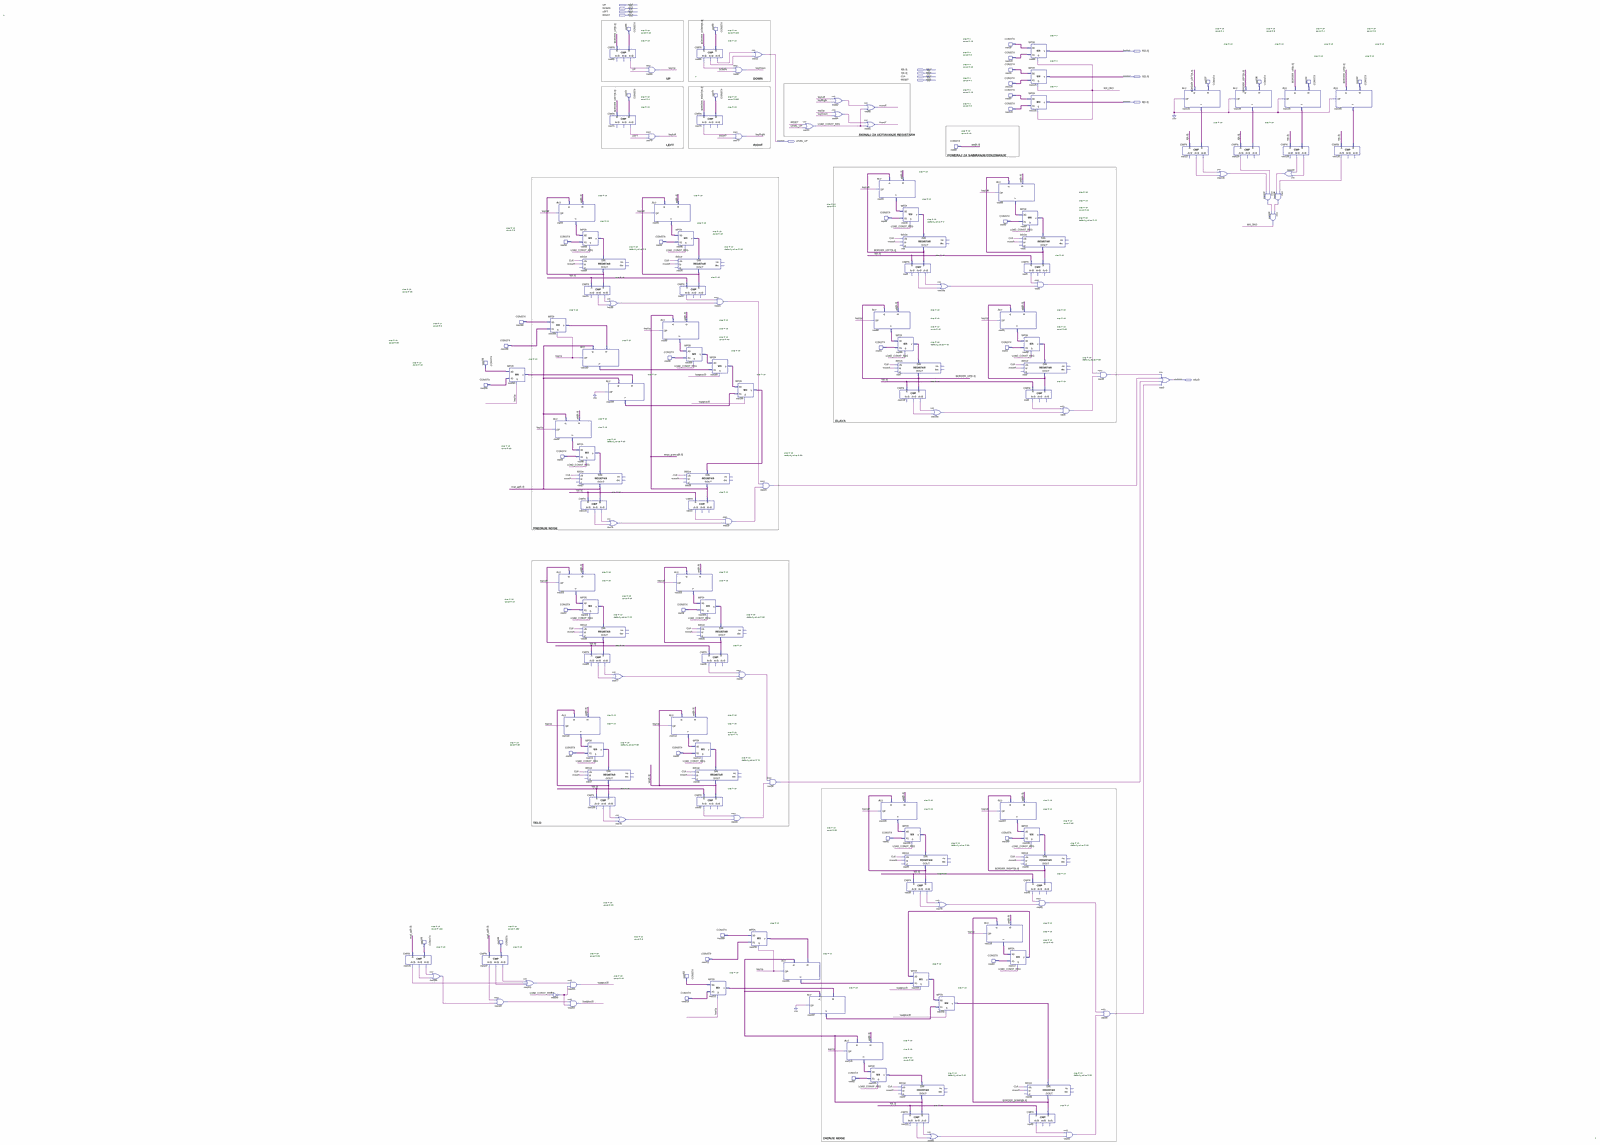
[diagram p0: schematic sheet, whole]
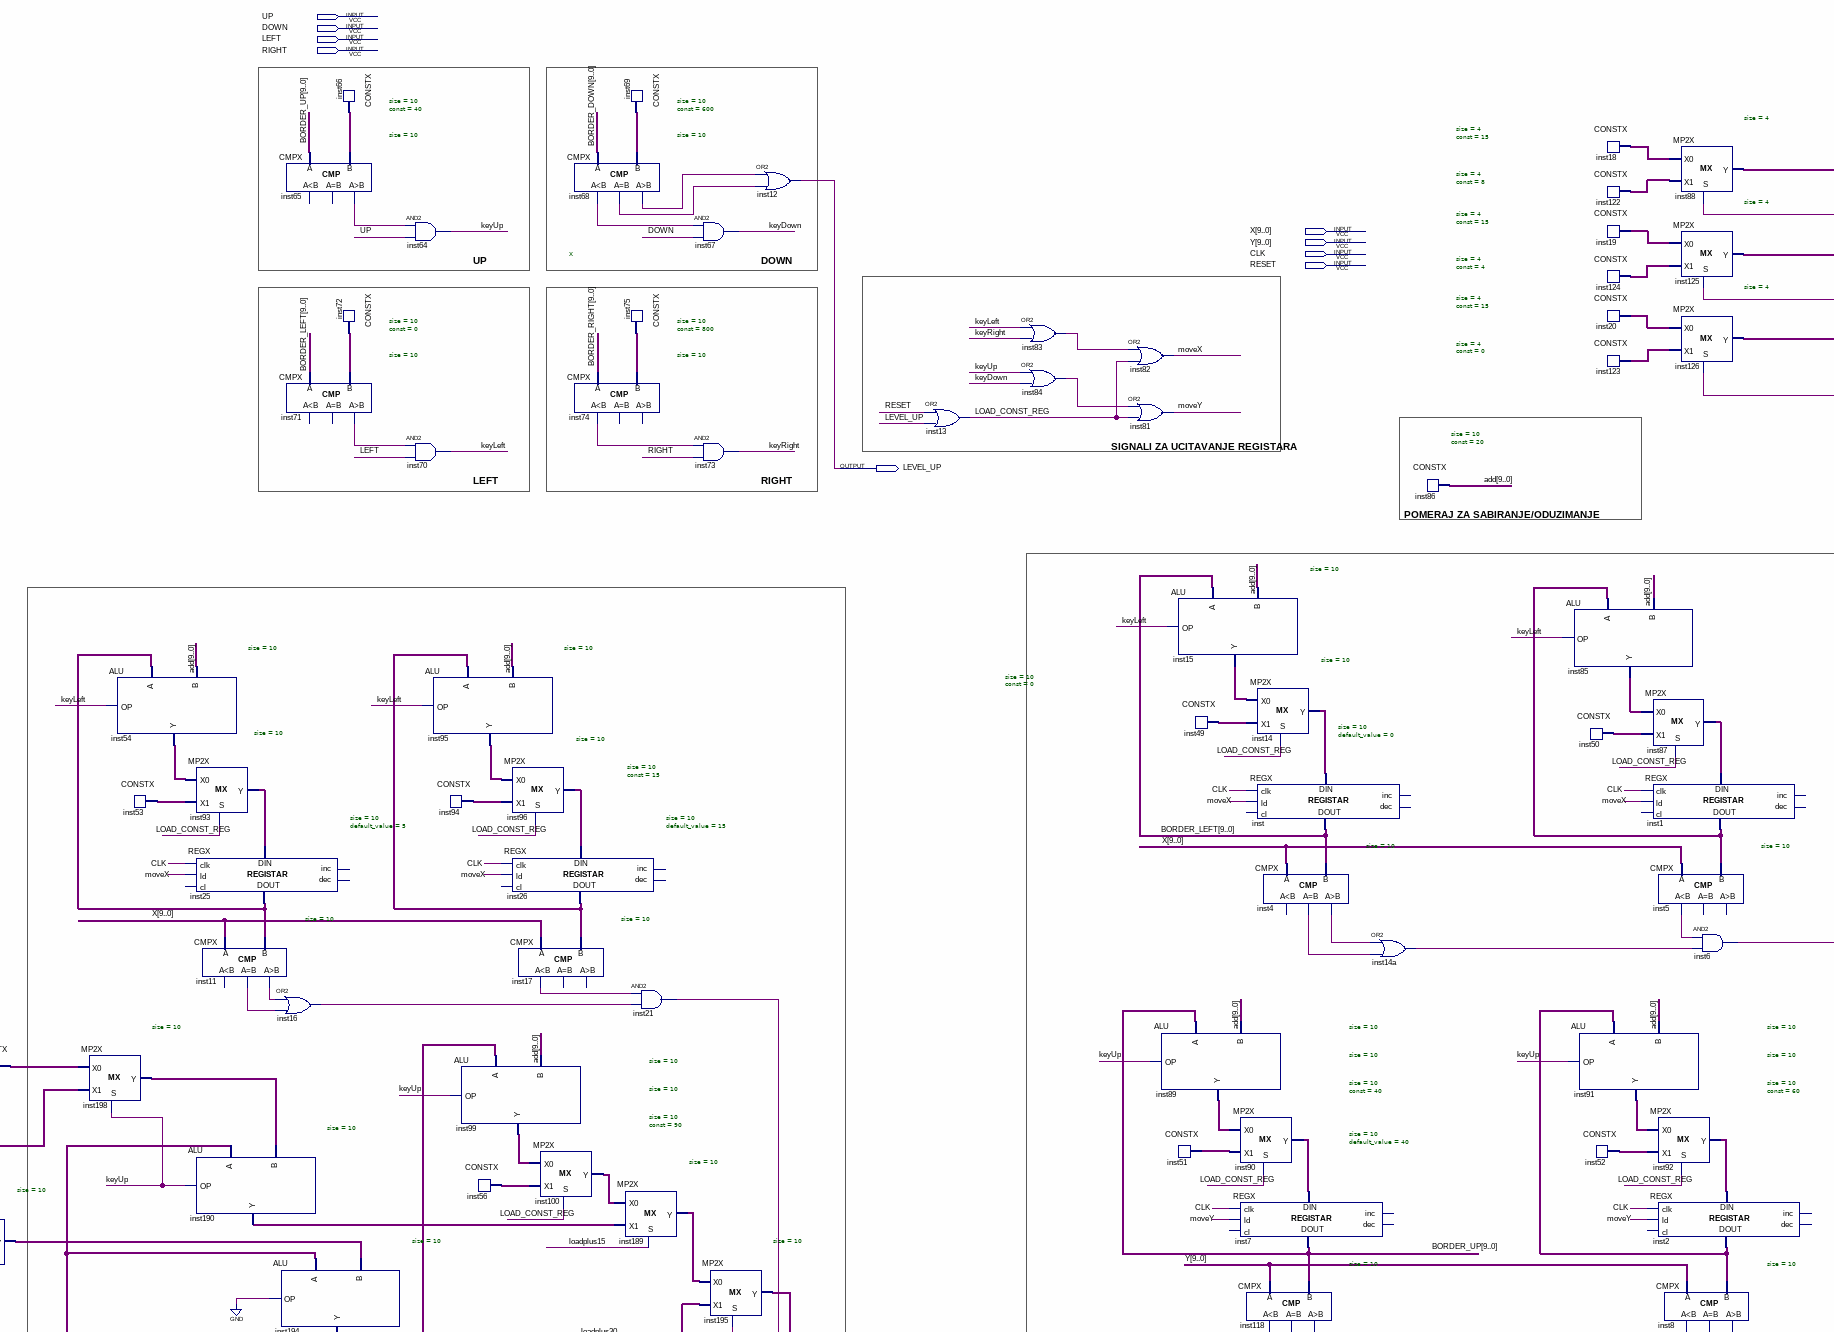
[diagram p1: schematic sheet, upper centre part]
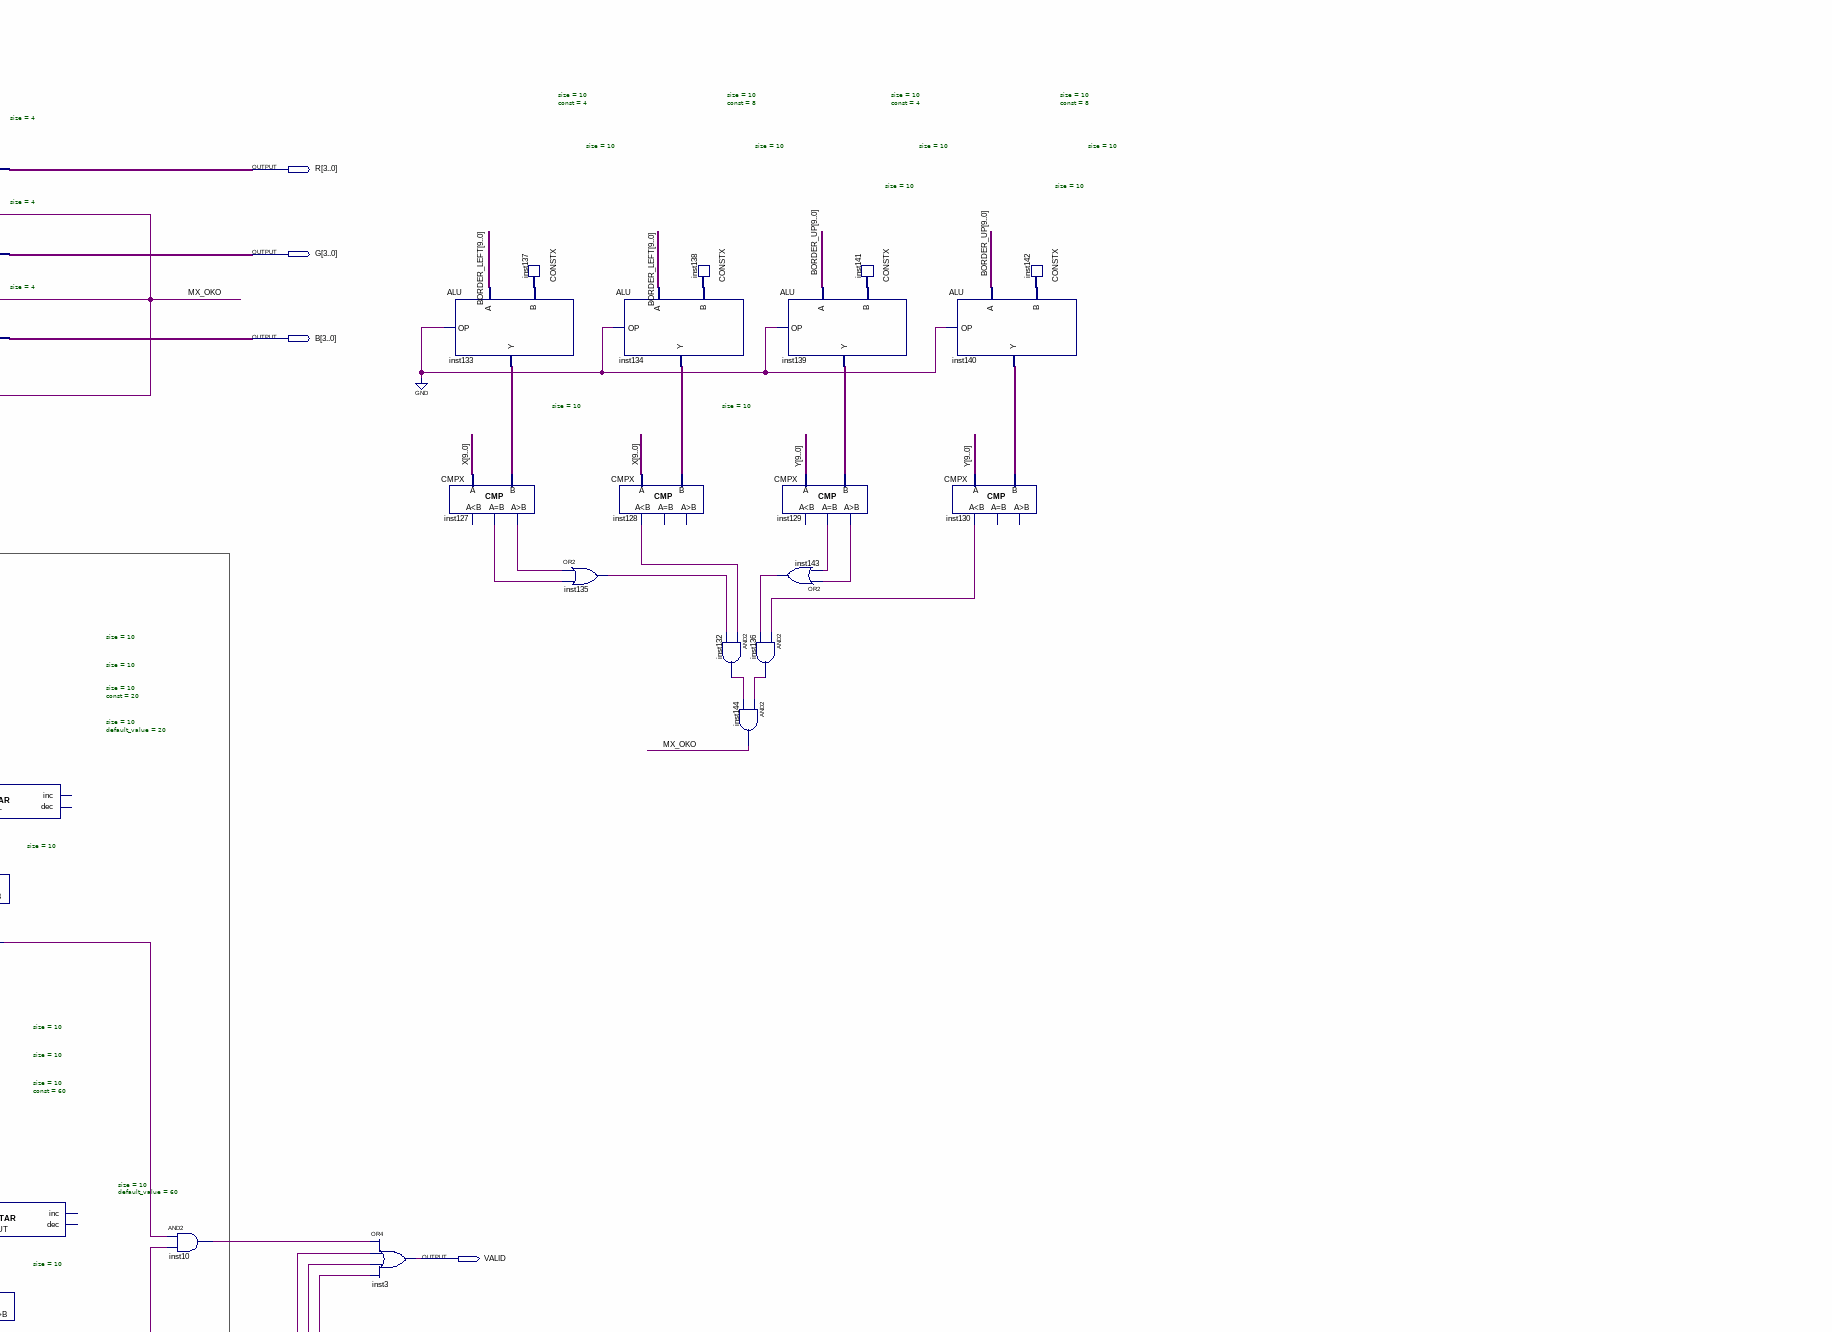
[diagram p2: schematic sheet, upper right part]
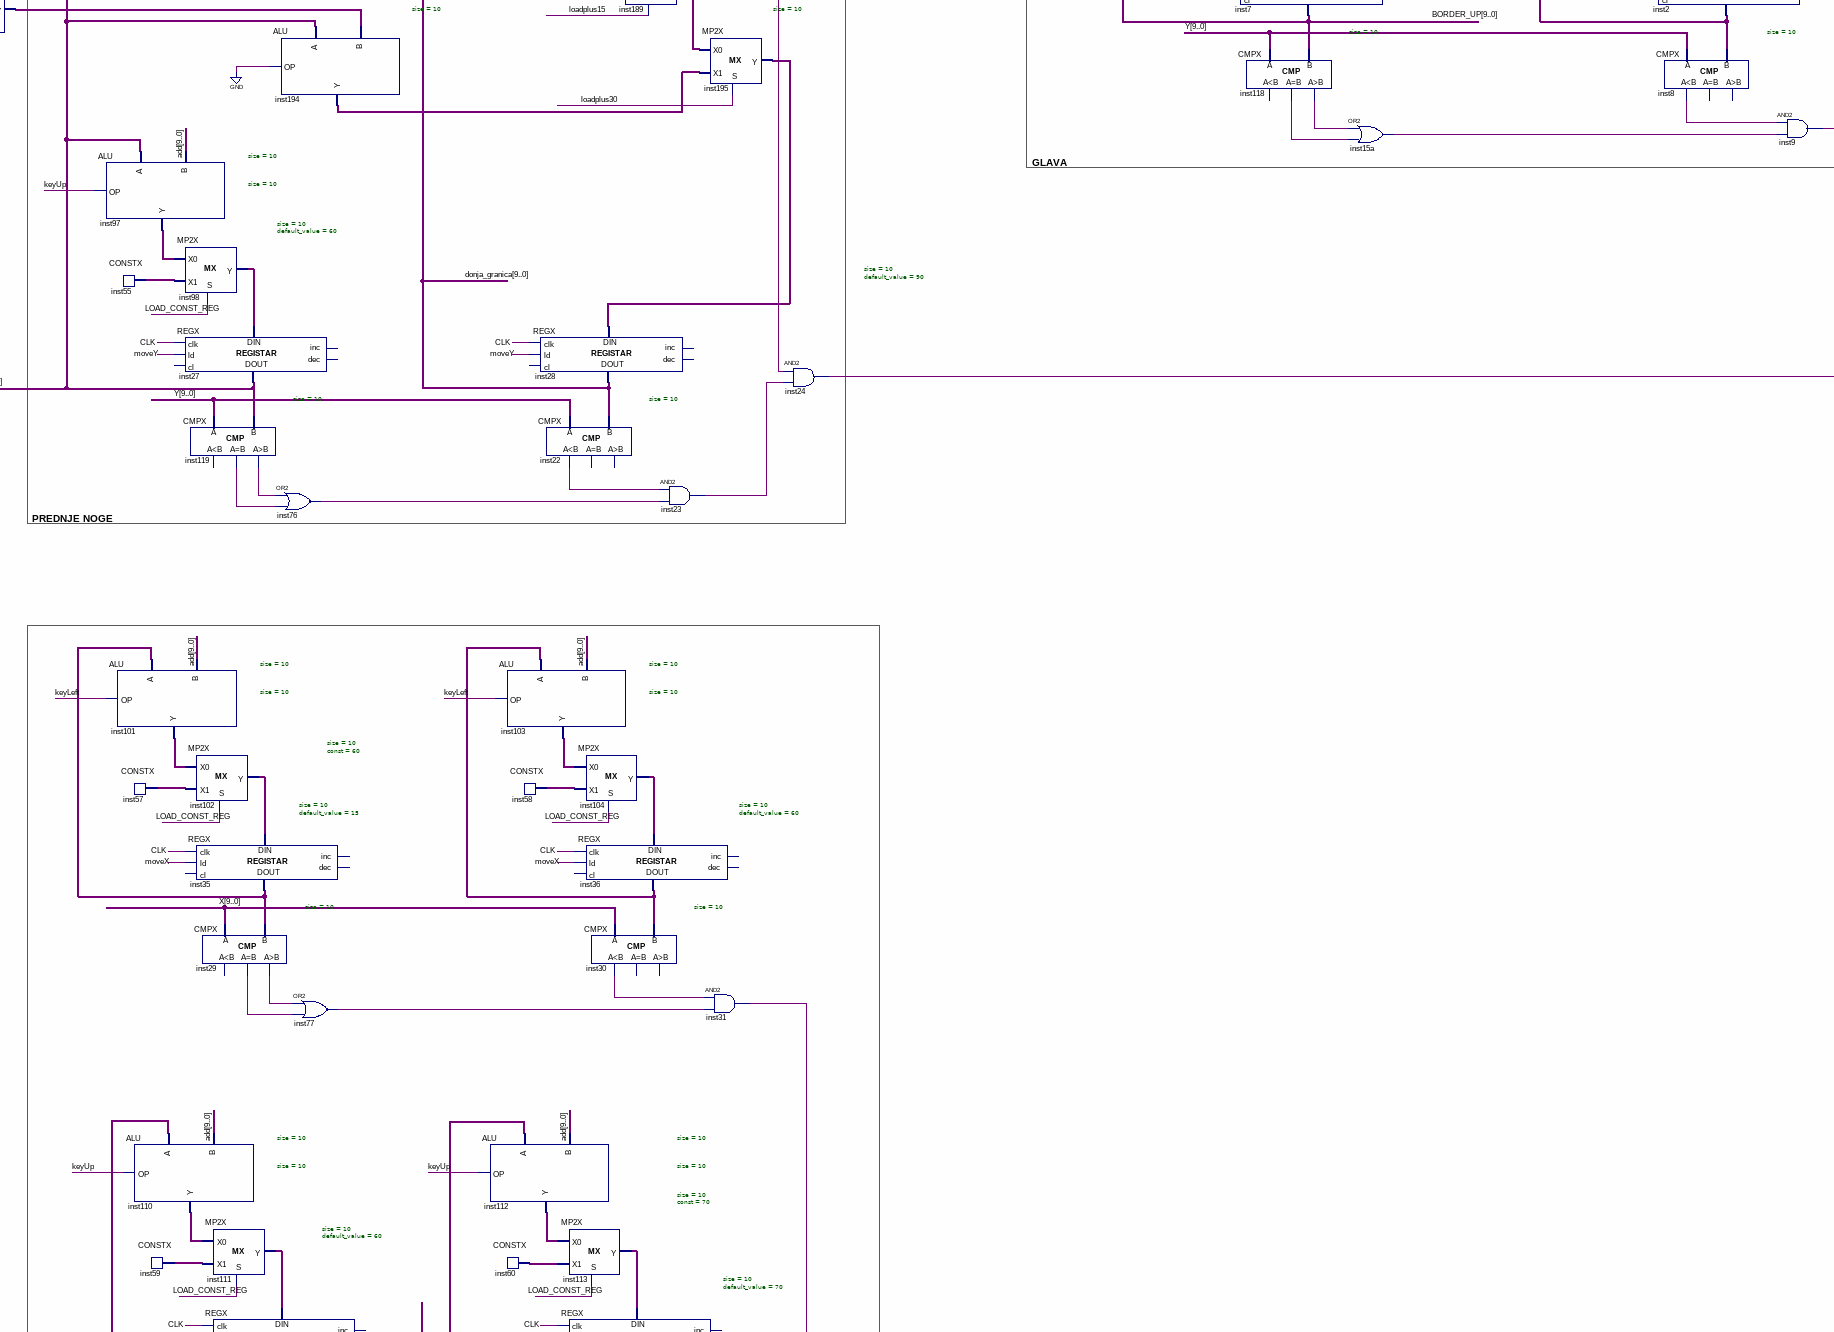
[diagram p3: schematic sheet, middle centre part]
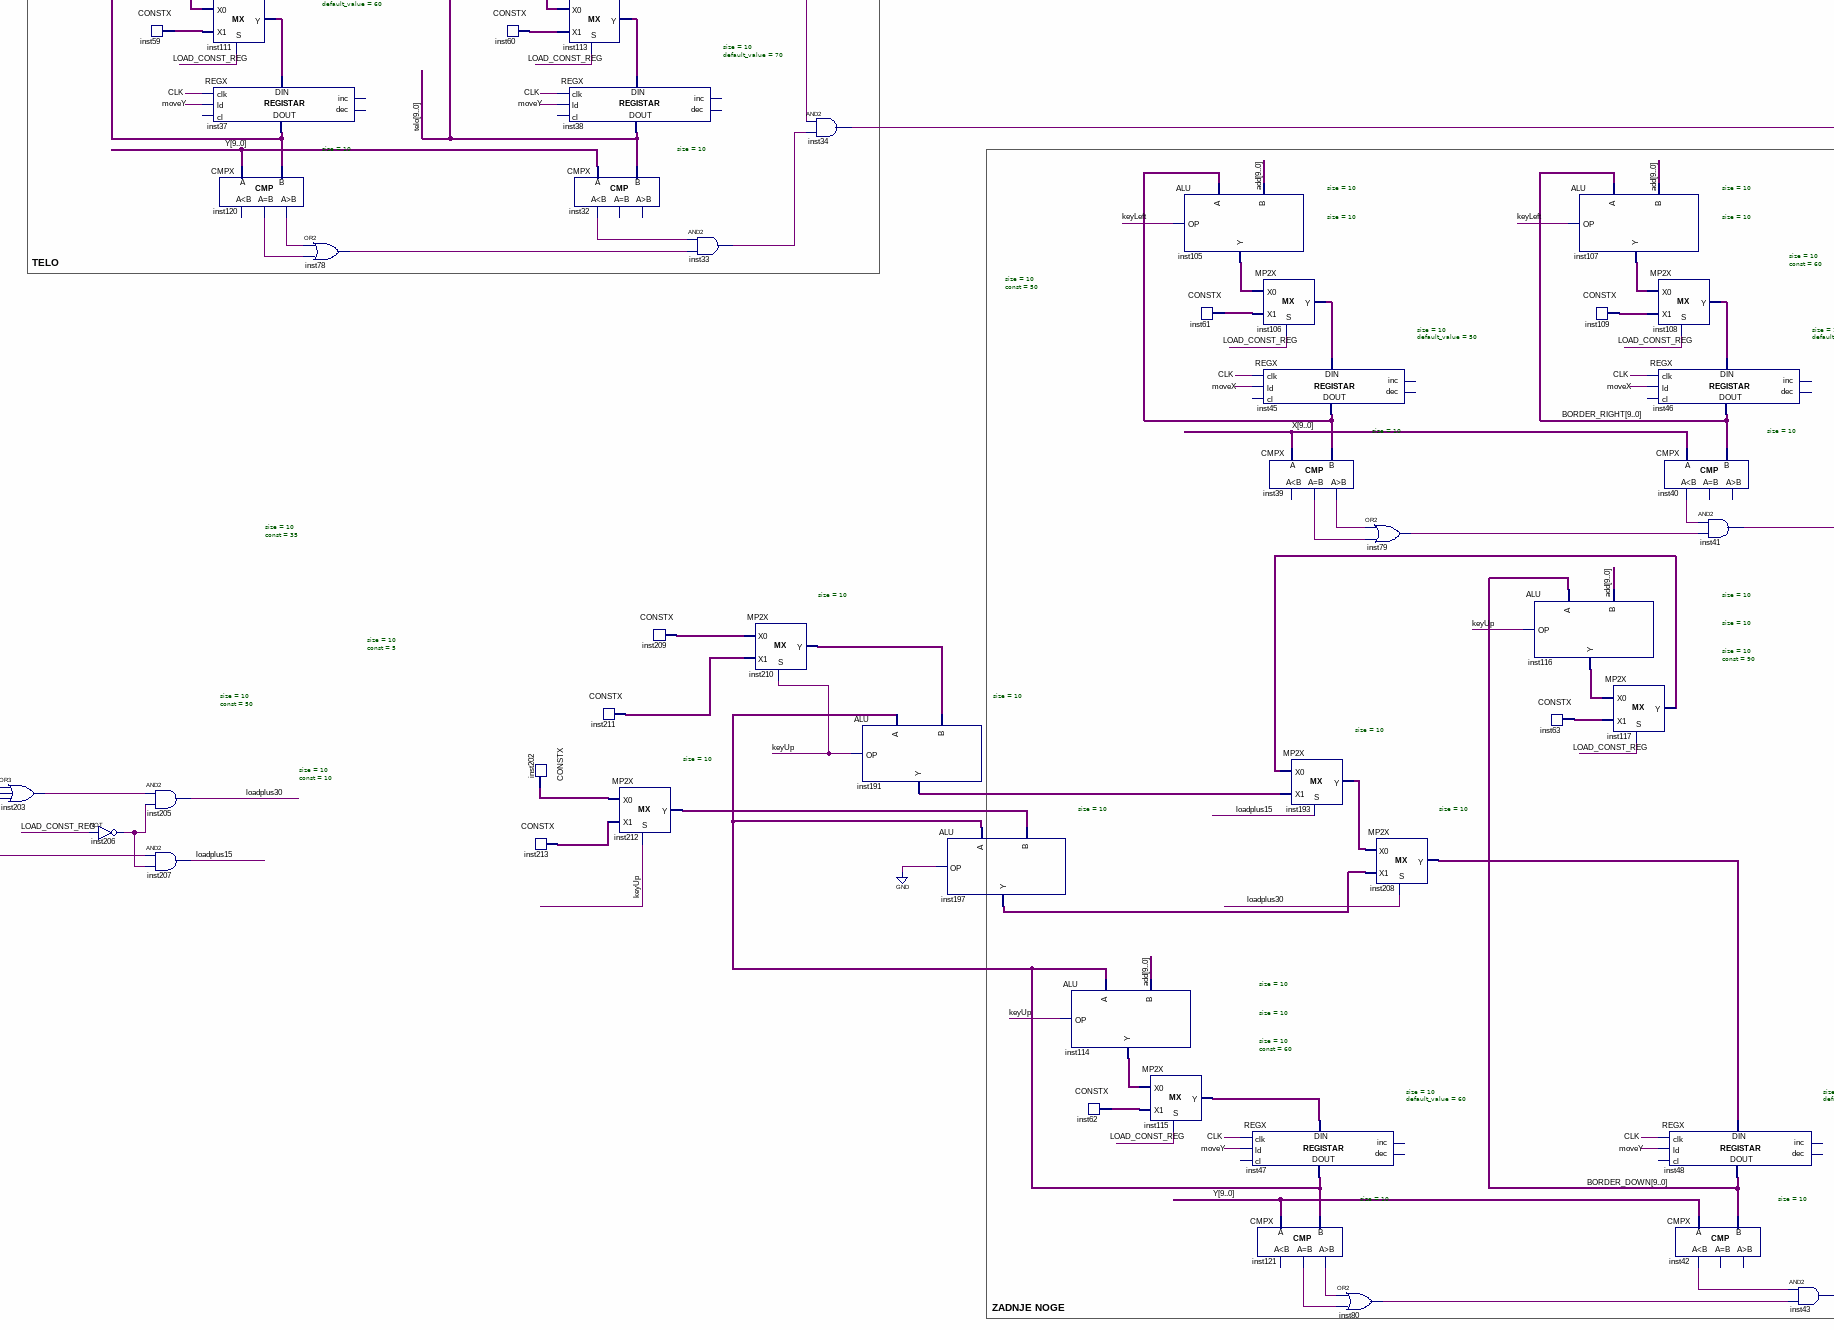
[diagram p4: schematic sheet, lower centre part]
// Quartus schematic Layer_Sheep.bdf as structural Verilog: 176 symbols, 13 pins
module Layer_Sheep (
  input  UP,
  input  DOWN,
  input  LEFT,
  input  RIGHT,
  input  [9:0] X,
  input  [9:0] Y,
  input  CLK,
  input  RESET,
  output [3:0] R,
  output [3:0] G,
  output [3:0] B,
  output LEVEL_UP,
  output VALID
);

  wire inst4_eq, inst4_gr, inst5_ls, inst6_out, inst8_ls, inst9_out, inst10_out, inst11_eq, inst11_gr,
       inst14a_out, inst15a_out, inst16_out, inst17_ls, inst21_out, inst22_ls, inst23_out, inst24_out,
       inst29_eq, inst29_gr, inst30_ls, inst31_out, inst32_ls, inst33_out, inst34_out, inst39_eq, inst39_gr,
       inst40_ls, inst41_out, inst42_ls, inst43_out, inst44_out, inst65_gr, inst68_eq, inst68_gr, inst68_ls,
       inst71_gr, inst74_ls, inst76_out, inst77_out, inst78_out, inst79_out, inst80_out, inst83_out,
       inst84_out, inst118_eq, inst118_gr, inst119_eq, inst119_gr, inst120_eq, inst120_gr, inst121_eq,
       inst121_gr, inst127_eq, inst127_gr, inst128_ls, inst129_eq, inst129_gr, inst130_ls, inst131_eq,
       inst131_gr, inst131_ls, inst132_out, inst135_out, inst136_out, inst143_out, inst147_eq, inst147_gr,
       inst147_ls, inst186_out, inst187_out, inst203_out, inst206_out, keyDown, keyLeft, keyRight, keyUp,
       LOAD_CONST_REG, loadplus15, loadplus30, moveX, moveY, MX_OKO;
  wire [3:0] inst18_data, inst19_data, inst20_data, inst122_data, inst123_data, inst124_data;
  wire [9:0] add, BORDER_DOWN, BORDER_LEFT, BORDER_RIGHT, BORDER_UP, donja_granica, inst1_data_out,
       inst2_data_out, inst14_y, inst15_result, inst25_data_out, inst26_data_out, inst35_data_out,
       inst36_data_out, inst37_data_out, inst45_data_out, inst47_data_out, inst49_data, inst50_data,
       inst51_data, inst52_data, inst53_data, inst54_result, inst55_data, inst56_data, inst57_data,
       inst58_data, inst59_data, inst60_data, inst61_data, inst62_data, inst63_data, inst66_data,
       inst69_data, inst72_data, inst75_data, inst85_result, inst87_y, inst89_result, inst90_y,
       inst91_result, inst92_y, inst93_y, inst94_data, inst95_result, inst96_y, inst97_result, inst98_y,
       inst99_result, inst100_y, inst101_result, inst102_y, inst103_result, inst104_y, inst105_result,
       inst106_y, inst107_result, inst108_y, inst109_data, inst110_result, inst111_y, inst112_result,
       inst113_y, inst114_result, inst115_y, inst116_result, inst117_y, inst133_result, inst134_result,
       inst137_data, inst138_data, inst139_result, inst140_result, inst141_data, inst142_data, inst146_data,
       inst148_data, inst189_y, inst190_result, inst191_result, inst192_data, inst193_y, inst194_result,
       inst195_y, inst196_data, inst197_result, inst198_y, inst199_data, inst200_y, inst201_data,
       inst202_data, inst208_y, inst209_data, inst210_y, inst211_data, inst212_y, inst213_data, mod_up, telo;

  CMPX #(.size(10)) inst131 (.A(mod_up), .B(inst146_data), .ls(inst131_ls), .eq(inst131_eq), .gr(inst131_gr));
  CONSTX #(.size(10), .\const (150)) inst146 (.data(inst146_data));
  or inst186 (inst186_out, inst131_gr, inst131_eq);
  CONSTX #(.size(10), .\const (50)) inst196 (.data(inst196_data));
  CONSTX #(.size(10), .\const (10)) inst201 (.data(inst201_data));
  CMPX #(.size(10)) inst147 (.A(mod_up), .B(inst148_data), .ls(inst147_ls), .eq(inst147_eq), .gr(inst147_gr));
  CONSTX #(.size(10), .\const (5)) inst199 (.data(inst199_data));
  CONSTX #(.size(10), .\const (480)) inst148 (.data(inst148_data));
  and inst187 (inst187_out, inst147_ls, inst186_out);
  CONSTX #(.size(10), .\const (35)) inst192 (.data(inst192_data));
  MP2X #(.size(10)) inst200 (.S(keyUp), .X0(inst196_data), .X1(inst201_data), .Y(inst200_y));
  or inst203 (inst203_out, inst147_gr, inst131_ls, inst147_eq);
  ALU #(.size(10)) inst54 (.op(keyLeft), .a(inst25_data_out), .b(add), .result(inst54_result));
  CONSTX #(.size(10), .\const (5)) inst53 (.data(inst53_data));
  MP2X #(.size(10)) inst198 (.S(keyUp), .X0(inst192_data), .X1(inst199_data), .Y(inst198_y));
  ALU #(.size(10)) inst97 (.op(keyUp), .a(mod_up), .b(add), .result(inst97_result));
  CONSTX #(.size(10), .\const (60)) inst55 (.data(inst55_data));
  ALU #(.size(10)) inst101 (.op(keyLeft), .a(inst35_data_out), .b(add), .result(inst101_result));
  CONSTX #(.size(10), .\const (15)) inst57 (.data(inst57_data));
  not inst206 (inst206_out, LOAD_CONST_REG);
  ALU #(.size(10)) inst110 (.op(keyUp), .a(inst37_data_out), .b(add), .result(inst110_result));
  CONSTX #(.size(10), .\const (60)) inst59 (.data(inst59_data));
  and inst205 (loadplus30, inst203_out, inst206_out);
  and inst207 (loadplus15, inst187_out, inst206_out);
  MP2X #(.size(10)) inst93 (.S(LOAD_CONST_REG), .X0(inst54_result), .X1(inst53_data), .Y(inst93_y));
  REGX #(.size(10), .default_value(5)) inst25 (
    .clk(CLK), .ld(moveX), .data_in(inst93_y), .data_out(inst25_data_out));  // open: cl, inc, dec
  CMPX #(.size(10)) inst11 (.A(X), .B(inst25_data_out), .eq(inst11_eq), .gr(inst11_gr));  // open: ls
  ALU #(.size(10)) inst190 (.op(keyUp), .a(mod_up), .b(inst198_y), .result(inst190_result));
  MP2X #(.size(10)) inst98 (.S(LOAD_CONST_REG), .X0(inst97_result), .X1(inst55_data), .Y(inst98_y));
  REGX #(.size(10), .default_value(60)) inst27 (
    .clk(CLK), .ld(moveY), .data_in(inst98_y), .data_out(mod_up));  // open: cl, inc, dec
  CMPX #(.size(10)) inst119 (.A(Y), .B(mod_up), .eq(inst119_eq), .gr(inst119_gr));  // open: ls
  MP2X #(.size(10)) inst102 (.S(LOAD_CONST_REG), .X0(inst101_result), .X1(inst57_data), .Y(inst102_y));
  REGX #(.size(10), .default_value(15)) inst35 (
    .clk(CLK), .ld(moveX), .data_in(inst102_y), .data_out(inst35_data_out));  // open: cl, inc, dec
  CMPX #(.size(10)) inst29 (.A(X), .B(inst35_data_out), .eq(inst29_eq), .gr(inst29_gr));  // open: ls
  MP2X #(.size(10)) inst111 (.S(LOAD_CONST_REG), .X0(inst110_result), .X1(inst59_data), .Y(inst111_y));
  REGX #(.size(10), .default_value(60)) inst37 (
    .clk(CLK), .ld(moveY), .data_in(inst111_y), .data_out(inst37_data_out));  // open: cl, inc, dec
  CMPX #(.size(10)) inst120 (.A(Y), .B(inst37_data_out), .eq(inst120_eq), .gr(inst120_gr));  // open: ls
  CMPX #(.size(10)) inst65 (.A(BORDER_UP), .B(inst66_data), .gr(inst65_gr));  // open: ls, eq
  CMPX #(.size(10)) inst71 (.A(BORDER_LEFT), .B(inst72_data), .gr(inst71_gr));  // open: ls, eq
  or inst16 (inst16_out, inst11_gr, inst11_eq);
  ALU #(.size(10)) inst194 (.op(1'b0), .a(mod_up), .b(inst200_y), .result(inst194_result));
  or inst76 (inst76_out, inst119_gr, inst119_eq);
  or inst77 (inst77_out, inst29_gr, inst29_eq);
  CONSTX #(.size(10), .\const (40)) inst66 (.data(inst66_data));
  CONSTX #(.size(10), .\const (0)) inst72 (.data(inst72_data));
  or inst78 (inst78_out, inst120_gr, inst120_eq);
  and inst64 (keyUp, inst65_gr, UP);
  and inst70 (keyLeft, inst71_gr, LEFT);
  ALU #(.size(10)) inst95 (.op(keyLeft), .a(inst26_data_out), .b(add), .result(inst95_result));
  CONSTX #(.size(10), .\const (15)) inst94 (.data(inst94_data));
  ALU #(.size(10)) inst99 (.op(keyUp), .a(donja_granica), .b(add), .result(inst99_result));
  CONSTX #(.size(10), .\const (90)) inst56 (.data(inst56_data));
  ALU #(.size(10)) inst112 (.op(keyUp), .a(telo), .b(add), .result(inst112_result));
  MP2X #(.size(10)) inst96 (.S(LOAD_CONST_REG), .X0(inst95_result), .X1(inst94_data), .Y(inst96_y));
  REGX #(.size(10), .default_value(15)) inst26 (
    .clk(CLK), .ld(moveX), .data_in(inst96_y), .data_out(inst26_data_out));  // open: cl, inc, dec
  CMPX #(.size(10)) inst17 (.A(X), .B(inst26_data_out), .ls(inst17_ls));  // open: eq, gr
  ALU #(.size(10)) inst103 (.op(keyLeft), .a(inst36_data_out), .b(add), .result(inst103_result));
  CONSTX #(.size(10), .\const (60)) inst58 (.data(inst58_data));
  CONSTX #(.size(10), .\const (70)) inst60 (.data(inst60_data));
  CONSTX #(.size(10), .\const (50)) inst202 (.data(inst202_data));
  CONSTX #(.size(10), .\const (10)) inst213 (.data(inst213_data));
  CMPX #(.size(10)) inst68 (.A(BORDER_DOWN), .B(inst69_data), .ls(inst68_ls), .eq(inst68_eq), .gr(inst68_gr));
  CMPX #(.size(10)) inst74 (.A(BORDER_RIGHT), .B(inst75_data), .ls(inst74_ls));  // open: eq, gr
  MP2X #(.size(10)) inst100 (.S(LOAD_CONST_REG), .X0(inst99_result), .X1(inst56_data), .Y(inst100_y));
  REGX #(.size(10), .default_value(90)) inst28 (
    .clk(CLK), .ld(moveY), .data_in(inst195_y), .data_out(donja_granica));  // open: cl, inc, dec
  CMPX #(.size(10)) inst22 (.A(Y), .B(donja_granica), .ls(inst22_ls));  // open: eq, gr
  MP2X #(.size(10)) inst113 (.S(LOAD_CONST_REG), .X0(inst112_result), .X1(inst60_data), .Y(inst113_y));
  REGX #(.size(10), .default_value(70)) inst38 (
    .clk(CLK), .ld(moveY), .data_in(inst113_y), .data_out(telo));  // open: cl, inc, dec
  CMPX #(.size(10)) inst32 (.A(Y), .B(telo), .ls(inst32_ls));  // open: eq, gr
  MP2X #(.size(10)) inst189 (.S(loadplus15), .X0(inst100_y), .X1(inst190_result), .Y(inst189_y));
  MP2X #(.size(10)) inst104 (.S(LOAD_CONST_REG), .X0(inst103_result), .X1(inst58_data), .Y(inst104_y));
  REGX #(.size(10), .default_value(60)) inst36 (
    .clk(CLK), .ld(moveX), .data_in(inst104_y), .data_out(inst36_data_out));  // open: cl, inc, dec
  CMPX #(.size(10)) inst30 (.A(X), .B(inst36_data_out), .ls(inst30_ls));  // open: eq, gr
  CONSTX #(.size(10), .\const (5)) inst211 (.data(inst211_data));
  MP2X #(.size(10)) inst212 (.S(keyUp), .X0(inst202_data), .X1(inst213_data), .Y(inst212_y));
  CONSTX #(.size(10), .\const (600)) inst69 (.data(inst69_data));
  CONSTX #(.size(10), .\const (800)) inst75 (.data(inst75_data));
  and inst21 (inst21_out, inst17_ls, inst16_out);
  and inst23 (inst23_out, inst22_ls, inst76_out);
  CONSTX #(.size(10), .\const (35)) inst209 (.data(inst209_data));
  and inst67 (keyDown, inst68_ls, DOWN);
  and inst73 (keyRight, inst74_ls, RIGHT);
  MP2X #(.size(10)) inst195 (.S(loadplus30), .X0(inst189_y), .X1(inst194_result), .Y(inst195_y));
  and inst31 (inst31_out, inst30_ls, inst77_out);
  and inst33 (inst33_out, inst32_ls, inst78_out);
  MP2X #(.size(10)) inst210 (.S(keyUp), .X0(inst209_data), .X1(inst211_data), .Y(inst210_y));
  or inst12 (LEVEL_UP, inst68_gr, inst68_eq);
  and inst24 (inst24_out, inst21_out, inst23_out);
  and inst34 (inst34_out, inst31_out, inst33_out);
  ALU #(.size(10)) inst191 (.op(keyUp), .a(inst47_data_out), .b(inst210_y), .result(inst191_result));
  or inst13 (LOAD_CONST_REG, RESET, LEVEL_UP);
  ALU #(.size(10)) inst197 (.op(1'b0), .a(inst47_data_out), .b(inst212_y), .result(inst197_result));
  or inst83 (inst83_out, keyLeft, keyRight);
  or inst84 (inst84_out, keyUp, keyDown);
  ALU #(.size(10)) inst114 (.op(keyUp), .a(inst47_data_out), .b(add), .result(inst114_result));
  CONSTX #(.size(10), .\const (60)) inst62 (.data(inst62_data));
  or inst82 (moveX, inst83_out, LOAD_CONST_REG);
  or inst81 (moveY, inst84_out, LOAD_CONST_REG);
  ALU #(.size(10)) inst89 (.op(keyUp), .a(BORDER_UP), .b(add), .result(inst89_result));
  MP2X #(.size(10)) inst115 (.S(LOAD_CONST_REG), .X0(inst114_result), .X1(inst62_data), .Y(inst115_y));
  ALU #(.size(10)) inst15 (.op(keyLeft), .a(BORDER_LEFT), .b(add), .result(inst15_result));
  CONSTX #(.size(10), .\const (0)) inst49 (.data(inst49_data));
  CONSTX #(.size(10), .\const (40)) inst51 (.data(inst51_data));
  ALU #(.size(10)) inst105 (.op(keyLeft), .a(inst45_data_out), .b(add), .result(inst105_result));
  CONSTX #(.size(10), .\const (50)) inst61 (.data(inst61_data));
  MP2X #(.size(10)) inst14 (.S(LOAD_CONST_REG), .X0(inst15_result), .X1(inst49_data), .Y(inst14_y));
  REGX #(.size(10), .default_value(0)) inst (
    .clk(CLK), .ld(moveX), .data_in(inst14_y), .data_out(BORDER_LEFT));  // open: cl, inc, dec
  MP2X #(.size(10)) inst90 (.S(LOAD_CONST_REG), .X0(inst89_result), .X1(inst51_data), .Y(inst90_y));
  REGX #(.size(10), .default_value(40)) inst7 (
    .clk(CLK), .ld(moveY), .data_in(inst90_y), .data_out(BORDER_UP));  // open: cl, inc, dec
  CMPX #(.size(10)) inst118 (.A(Y), .B(BORDER_UP), .eq(inst118_eq), .gr(inst118_gr));  // open: ls
  REGX #(.size(10), .default_value(60)) inst47 (
    .clk(CLK), .ld(moveY), .data_in(inst115_y), .data_out(inst47_data_out));  // open: cl, inc, dec
  CMPX #(.size(10)) inst121 (.A(Y), .B(inst47_data_out), .eq(inst121_eq), .gr(inst121_gr));  // open: ls
  CMPX #(.size(10)) inst4 (.A(X), .B(BORDER_LEFT), .eq(inst4_eq), .gr(inst4_gr));  // open: ls
  MP2X #(.size(10)) inst106 (.S(LOAD_CONST_REG), .X0(inst105_result), .X1(inst61_data), .Y(inst106_y));
  REGX #(.size(10), .default_value(50)) inst45 (
    .clk(CLK), .ld(moveX), .data_in(inst106_y), .data_out(inst45_data_out));  // open: cl, inc, dec
  CMPX #(.size(10)) inst39 (.A(X), .B(inst45_data_out), .eq(inst39_eq), .gr(inst39_gr));  // open: ls
  MP2X #(.size(10)) inst193 (.S(loadplus15), .X0(inst117_y), .X1(inst191_result), .Y(inst193_y));
  or inst80 (inst80_out, inst121_gr, inst121_eq);
  or inst14a (inst14a_out, inst4_gr, inst4_eq);
  or inst15a (inst15a_out, inst118_gr, inst118_eq);
  or inst79 (inst79_out, inst39_gr, inst39_eq);
  MP2X #(.size(10)) inst208 (.S(loadplus30), .X0(inst193_y), .X1(inst197_result), .Y(inst208_y));
  CONSTX #(.size(10), .\const (20)) inst86 (.data(add));
  ALU #(.size(10)) inst85 (.op(keyLeft), .a(inst1_data_out), .b(add), .result(inst85_result));
  ALU #(.size(10)) inst116 (.op(keyUp), .a(BORDER_DOWN), .b(add), .result(inst116_result));
  CONSTX #(.size(10), .\const (90)) inst63 (.data(inst63_data));
  CONSTX #(.size(4), .\const (15)) inst18 (.data(inst18_data));
  CONSTX #(.size(4), .\const (8)) inst122 (.data(inst122_data));
  CONSTX #(.size(4), .\const (15)) inst19 (.data(inst19_data));
  CONSTX #(.size(4), .\const (4)) inst124 (.data(inst124_data));
  CONSTX #(.size(4), .\const (15)) inst20 (.data(inst20_data));
  CONSTX #(.size(4), .\const (0)) inst123 (.data(inst123_data));
  CONSTX #(.size(10), .\const (20)) inst50 (.data(inst50_data));
  ALU #(.size(10)) inst91 (.op(keyUp), .a(inst2_data_out), .b(add), .result(inst91_result));
  CONSTX #(.size(10), .\const (60)) inst52 (.data(inst52_data));
  ALU #(.size(10)) inst107 (.op(keyLeft), .a(BORDER_RIGHT), .b(add), .result(inst107_result));
  CONSTX #(.size(10), .\const (60)) inst109 (.data(inst109_data));
  MP2X #(.size(10)) inst117 (.S(LOAD_CONST_REG), .X0(inst116_result), .X1(inst63_data), .Y(inst117_y));
  MP2X #(.size(10)) inst87 (.S(LOAD_CONST_REG), .X0(inst85_result), .X1(inst50_data), .Y(inst87_y));
  REGX #(.size(10), .default_value(20)) inst1 (
    .clk(CLK), .ld(moveX), .data_in(inst87_y), .data_out(inst1_data_out));  // open: cl, inc, dec
  CMPX #(.size(10)) inst5 (.A(X), .B(inst1_data_out), .ls(inst5_ls));  // open: eq, gr
  MP2X #(.size(10)) inst92 (.S(LOAD_CONST_REG), .X0(inst91_result), .X1(inst52_data), .Y(inst92_y));
  REGX #(.size(10), .default_value(60)) inst2 (
    .clk(CLK), .ld(moveY), .data_in(inst92_y), .data_out(inst2_data_out));  // open: cl, inc, dec
  CMPX #(.size(10)) inst8 (.A(Y), .B(inst2_data_out), .ls(inst8_ls));  // open: eq, gr
  MP2X #(.size(10)) inst108 (.S(LOAD_CONST_REG), .X0(inst107_result), .X1(inst109_data), .Y(inst108_y));
  REGX #(.size(10), .default_value(60)) inst46 (
    .clk(CLK), .ld(moveX), .data_in(inst108_y), .data_out(BORDER_RIGHT));  // open: cl, inc, dec
  CMPX #(.size(10)) inst40 (.A(X), .B(BORDER_RIGHT), .ls(inst40_ls));  // open: eq, gr
  MP2X #(.size(4)) inst88 (.S(MX_OKO), .X0(inst18_data), .X1(inst122_data), .Y(R));
  MP2X #(.size(4)) inst125 (.S(MX_OKO), .X0(inst19_data), .X1(inst124_data), .Y(G));
  MP2X #(.size(4)) inst126 (.S(MX_OKO), .X0(inst20_data), .X1(inst123_data), .Y(B));
  and inst6 (inst6_out, inst5_ls, inst14a_out);
  and inst41 (inst41_out, inst40_ls, inst79_out);
  REGX #(.size(10), .default_value(90)) inst48 (
    .clk(CLK), .ld(moveY), .data_in(inst208_y), .data_out(BORDER_DOWN));  // open: cl, inc, dec
  CMPX #(.size(10)) inst42 (.A(Y), .B(BORDER_DOWN), .ls(inst42_ls));  // open: eq, gr
  and inst9 (inst9_out, inst8_ls, inst15a_out);
  and inst43 (inst43_out, inst42_ls, inst80_out);
  and inst10 (inst10_out, inst6_out, inst9_out);
  and inst44 (inst44_out, inst41_out, inst43_out);
  or inst3 (VALID, inst10_out, inst24_out, inst34_out, inst44_out);
  ALU #(.size(10)) inst133 (.op(1'b0), .a(BORDER_LEFT), .b(inst137_data), .result(inst133_result));
  CMPX #(.size(10)) inst127 (.A(X), .B(inst133_result), .eq(inst127_eq), .gr(inst127_gr));  // open: ls
  CONSTX #(.size(10), .\const (4)) inst137 (.data(inst137_data));
  or inst135 (inst135_out, inst127_gr, inst127_eq);
  ALU #(.size(10)) inst134 (.op(1'b0), .a(BORDER_LEFT), .b(inst138_data), .result(inst134_result));
  CMPX #(.size(10)) inst128 (.A(X), .B(inst134_result), .ls(inst128_ls));  // open: eq, gr
  CONSTX #(.size(10), .\const (8)) inst138 (.data(inst138_data));
  and inst132 (inst132_out, inst128_ls, inst135_out);
  and inst144 (MX_OKO, inst136_out, inst132_out);
  ALU #(.size(10)) inst139 (.op(1'b0), .a(BORDER_UP), .b(inst141_data), .result(inst139_result));
  CMPX #(.size(10)) inst129 (.A(Y), .B(inst139_result), .eq(inst129_eq), .gr(inst129_gr));  // open: ls
  or inst143 (inst143_out, inst129_gr, inst129_eq);
  and inst136 (inst136_out, inst130_ls, inst143_out);
  CONSTX #(.size(10), .\const (4)) inst141 (.data(inst141_data));
  ALU #(.size(10)) inst140 (.op(1'b0), .a(BORDER_UP), .b(inst142_data), .result(inst140_result));
  CMPX #(.size(10)) inst130 (.A(Y), .B(inst140_result), .ls(inst130_ls));  // open: eq, gr
  CONSTX #(.size(10), .\const (8)) inst142 (.data(inst142_data));

  // Notes on the sheet:
  //   x
  //   x
  //   UP
  //   DOWN
  //   SIGNALI ZA UCITAVANJE REGISTARA
  //   LEFT
  //   RIGHT
  //   POMERAJ ZA SABIRANJE/ODUZIMANJE
  //   GLAVA
  //   PREDNJE NOGE
  //   TELO
  //   ZADNJE NOGE
  //   x
endmodule
